# Altium project Mems_board.PrjPcb
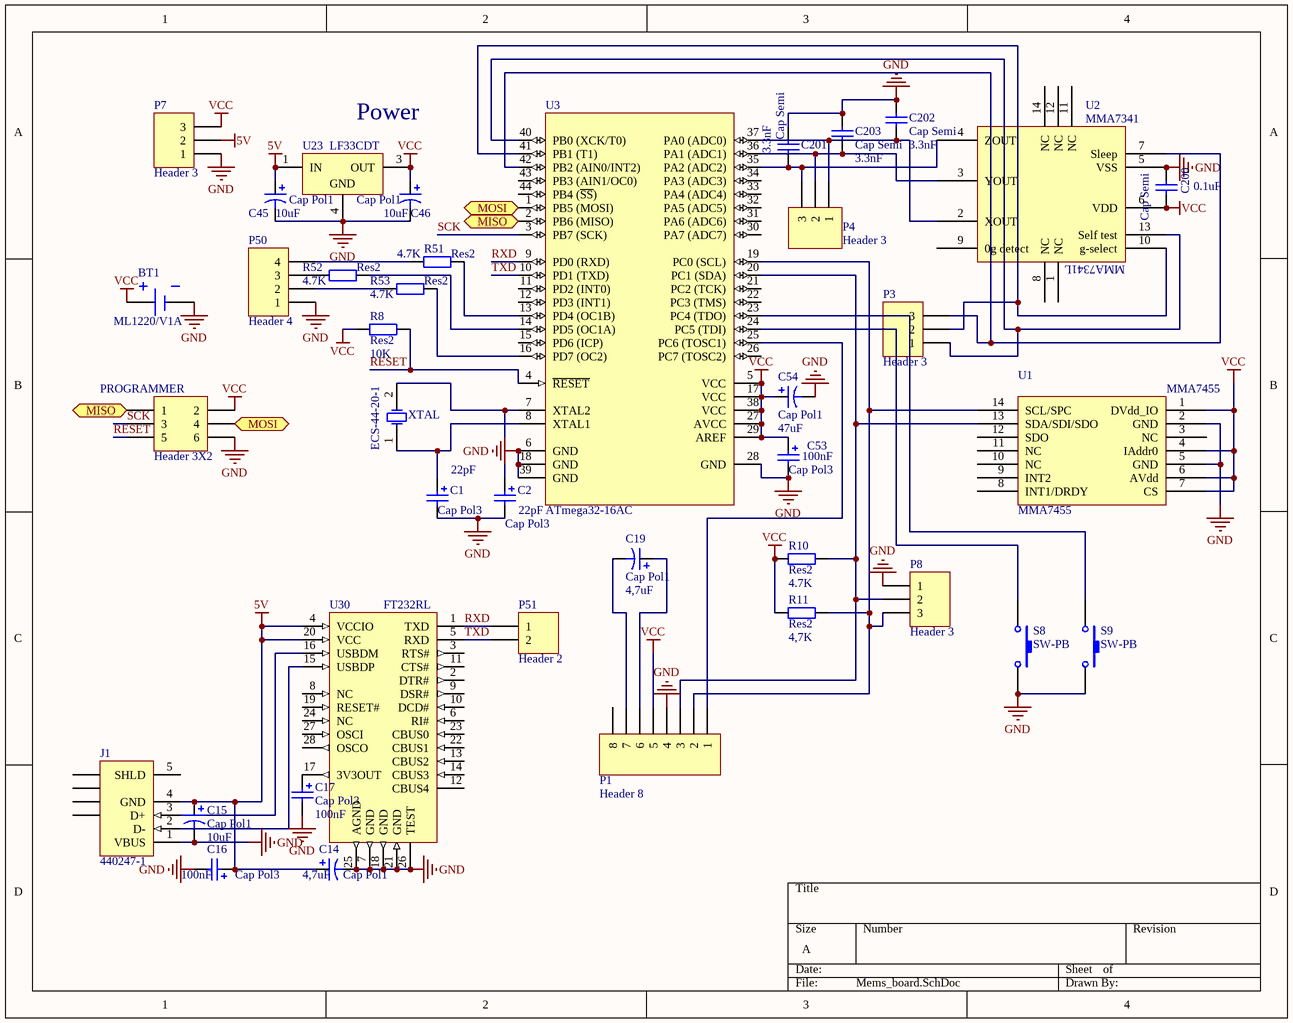
[diagram p0: Mems_board.SchDoc]
1 sheet, 39 parts. Net scope: flat (ports and power ports of the same name join across sheets).
Board files: Mems_board.PcbDoc, Mems_board_Panelize.PcbDoc

## Sheet Mems_board.SchDoc
size A

### Parts
BT1  ML1220/V1A  [ML1220-V]
C1  Cap Pol3  value 22pF  [RESC2012N]
C2  Cap Pol3  value 22pF  [RESC2012N]
C14  Cap Pol1  value 4,7uF  [CAPPR1.5-4x5]
C15  Cap Pol1  value 10uF  [CAPPR1.5-4x5]
C16  Cap Pol3  value 100nF  [RESC2012N]
C17  Cap Pol3  value 100nF  [RESC2012N]
C19  Cap Pol1  value 4,7uF  [CAPPR1.5-4x5]
C45  Cap Pol1  value 10uF  [CAPPR1.5-4x5]
C46  Cap Pol1  value 10uF  [CAPPR1.5-4x5]
C53  Cap Pol3  value 100nF  [RESC2012N]
C54  Cap Pol1  value 47uF  [CAPPR1.5-4x5]
C200  Cap Semi  value 0.1uF  [RESC2012N]
C201  Cap Semi  value 3.3nF  [RESC2012N]
C202  Cap Semi  value 3.3nF  [RESC2012N]
C203  Cap Semi  value 3.3nF  [RESC2012N]
J1  440247-1  [440247]
P1  Header 8  [FFC/SM1.0-2H8]
P3  Header 3  [HDR1X3]
P4  Header 3  [HDR1X3]
P7  Header 3  [HDR1X3]
P8  Header 3  [HDR1X3]
P50  Header 4  [HDR1X4]
P51  Header 2  [HDR1X2]
PROGRAMMER  Header 3X2  [HDR2X3]
R8  Res2  value 10K  [RESC2012N]
R10  Res2  value 4.7K  [RESC2012N]
R11  Res2  value 4,7K  [RESC2012N]
R51  Res2  value 4.7K  [RESC1608L]
R52  Res2  value 4.7K  [RESC1608L]
R53  Res2  value 4.7K  [RESC1608L]
S8  SW-PB  [HDR1X2]
S9  SW-PB  [HDR1X2]
U1  MMA7455  [LGA14 - duplicate]
U2  MMA7341  [LGA14 - duplicate]
U3  ATmega32-16AC  [44A_N]
U23  LF33CDT  [TO-252]
U30  FT232RL  [SSOP28]
XTAL  ECS-44-20-1  [HC-49U]

### Ports
MISO, MOSI

### Nets
5V: C14.1 C15.1 C16.1 C45.1 J1.4(GND) P7.2 U23.1(IN) U30.4(VCCIO) U30.20(VCC)
GND: BT1.2(-) C1.2 C2.2 C14.2 C15.2 C16.2 C17.2 C45.2 C46.2 C53.2 C54.2 C200.2 C201.2 C202.1 C203.1 J1.1(VBUS) P1.4 P7.1 P8.1 P50.1 PROGRAMMER.6 S8.2 S9.2 U1.2(GND) U1.5(GND) U2.5(VSS) U3.6(GND) U3.18(GND) U3.28(GND) U3.39(GND) U23.4(GND) U30.7(GND) U30.18(GND) U30.21(GND) U30.25(AGND) U30.26(TEST)
VCC: BT1.1(+) C46.1 C53.1 C54.1 C200.1 P1.5 P7.3 PROGRAMMER.2 R8.1 R10.1 R11.1 U1.1(DVdd_IO) U1.4(IAddr0) U1.6(AVdd) U1.7(CS) U2.6(VDD) U3.5(VCC) U3.17(VCC) U3.27(AVCC) U3.29(AREF) U3.38(VCC) U23.3(OUT)
RESET: PROGRAMMER.5 R8.2 U3.4(~{RESET})
RXD: P51.1 U3.9(PD0_(RXD)) U30.1(TXD)
SCK: PROGRAMMER.3 U3.3(PB7_(SCK))
TXD: P51.2 U3.10(PD1_(TXD)) U30.5(RXD)
NetC1_1: C1.1 U3.8(XTAL1) XTAL.1(OSC1)
NetC2_1: C2.1 U3.7(XTAL2) XTAL.2(OSC2)
NetC17_1: C17.1 U30.17(3V3OUT)
NetC19_1: C19.1 P1.6
NetC19_2: C19.2 P1.7
NetC201_1: C201.1 P4.3 U2.4(ZOUT) U3.35(PA2_(ADC2))
NetC202_2: C202.2 P4.1 U2.2(XOUT) U3.37(PA0_(ADC0))
NetC203_2: C203.2 P4.2 U2.3(YOUT) U3.36(PA1_(ADC1))
NetJ1_2: J1.2(D-) U30.15(USBDP)
NetJ1_3: J1.3(D+) U30.16(USBDM)
NetP1_1: P1.1 U3.25(PC6_(TOSC1))
NetP1_2: P1.2 P8.3 R11.2 U1.14(SCL/SPC) U3.19(PC0_(SCL))
NetP1_3: P1.3 P8.2 R10.2 U1.13(SDA/SDI/SDO) U3.20(PC1_(SDA))
NetP3_1: P3.1 U2.13(Self_test) U3.40(PB0_(XCK/T0))
NetP3_2: P3.2 U2.10(g-select) U3.41(PB1_(T1))
NetP3_3: P3.3 U2.7(Sleep) U3.42(PB2_(AIN0/INT2))
NetP50_2: P50.2 R53.1
NetP50_3: P50.3 R52.1
NetP50_4: P50.4 R51.1
NetPROGRAMMER_1: PROGRAMMER.1 U3.2(PB6_(MISO)) ; port MISO
NetPROGRAMMER_4: PROGRAMMER.4 U3.1(PB5_(MOSI)) ; port MOSI
NetR51_2: R51.2 U3.13(PD4_(OC1B))
NetR52_2: R52.2 U3.14(PD5_(OC1A))
NetR53_2: R53.2 U3.16(PD7_(OC2))
NetS8_1: S8.1 U3.24(PC5_(TDI))
NetS9_1: S9.1 U3.23(PC4_(TDO))

Not connected (* = marked no-connect by the designer): J1 5(SHLD) 6(SHLD) 7(SHLD) 8(SHLD) 9(SHLD); P1 8; U1 3(NC) 8(INT1/DRDY) 9(INT2) 10(NC) 11(NC) 12(SDO); U2 1(NC) 8(NC) 9(0g_detect) 11(NC) 12(NC) 14(NC); U3 11(PD2_(INT0)) 12(PD3_(INT1)) 15(PD6_(ICP)) 21(PC2_(TCK)) 22(PC3_(TMS)) 26(PC7_(TOSC2)) 30(PA7_(ADC7)) 31(PA6_(ADC6)) 32(PA5_(ADC5)) 33(PA4_(ADC4)) 34(PA3_(ADC3)) 43(PB3_(AIN1/OC0)) 44(PB4_(~{SS})); U30 2(DTR#) 3(RTS#) 6(RI#) 8(NC) 9(DSR#) 10(DCD#) 11(CTS#) 12(CBUS4) 13(CBUS2) 14(CBUS3) 19(RESET#) 22(CBUS1) 23(CBUS0) 24(NC) 27(OSCI) 28(OSCO)

### Notes on the sheet
- (near U23) Power
- (in symbol MMA7341) MMA7341L

### Library data of the parts
BT1 = ML1220/V1A: Manganese Rechargeable Lithium Battery with Legs, 3V, 17mAh, Vertical Coin-Type, 12.5x2mm (Dia.xH); Published: 30-May-2008; DatasheetVersion: Sep-2006; PackageVersion: Sep-2002; PackageReference: ML1220-V; Publisher: Altium Limited; PackageDescription: Lithium Disk Battery, Thru-Hole, Vertical; Body 12.5 x 2.6 mm (Dia.xW typ); ComponentLink1Description: Manufacturer Link; ComponentLink1URL: http://industrial.panasonic.com/; ComponentLink2Description: Datasheet; ComponentLink2URL: http://industrial.panasonic.com/www-data/pdf2/AAA4000/AAA4000CE69.pdf
C1 C2 C16 C17 C53 = Cap Pol3: Polarized Capacitor (Surface Mount); Published: 8-Jun-2000; LatestRevisionDate: 17-Jul-2002; LatestRevisionNote: Re-released for DXP Platform.; PackageReference: C0805; Publisher: Altium Limited
C14 C15 C19 C45 C46 C54 = Cap Pol1: Polarized Capacitor (Radial); Published: 8-Jun-2000; LatestRevisionDate: 17-Jul-2002; LatestRevisionNote: Re-released for DXP Platform.; PackageReference: RB7.6-15; Publisher: Altium Limited
C200-C203 = Cap Semi: Capacitor (Semiconductor SIM Model); Published: 8-Jun-2000; LatestRevisionDate: 29-May-2009; LatestRevisionNote: IPC-7351 Footprint Added.; PackageReference: C1206; Publisher: Altium Limited; PackageDescription: Chip Capacitor
J1 = 440247-1: USB 2.0, Right Angle, SMT, B Type, Receptacle, 5 Position, Black; ContactMaterial: Copper Alloy; ContactPlating: Gold (30); PCB_Layout: Complies with manufacturer's recommendation.; DrillSize: Corresponds to nominal value.; PanelGround: Without; Published: 15-Jul-2004; DatasheetDocument: 27-Jun-2003; PackageDocument: 27-Jun-2003; PackageReference: 440247; Publisher: Altium Limited; HousingMaterial: Thermoplastic; ComponentLink1Description: Manufacturer Link; ComponentLink1URL: http://www.tycoelectronics.com/; ComponentLink2Description: Packaging Specification; ComponentLink2URL: http://ecommas.tycoelectronics.com/commerce/DocumentDelivery/DDEController?Action=showdoc&DocId=Customer+Drawing%7F440247%7FD%7Fpdf%7FEnglish%7FC_440247_D.pdf
P1 = Header 8: Header, 8-Pin; LatestRevisionDate: 17-Jul-2002; LatestRevisionNote: Re-released for DXP Platform.; Publisher: Altium Limited
P3 P4 P7 P8 = Header 3: Header, 3-Pin; LatestRevisionDate: 17-Jul-2002; LatestRevisionNote: Re-released for DXP Platform.; Publisher: Altium Limited
P50 = Header 4: Header, 4-Pin; LatestRevisionDate: 17-Jul-2002; LatestRevisionNote: Re-released for DXP Platform.; Publisher: Altium Limited
P51 = Header 2: Header, 2-Pin; LatestRevisionDate: 17-Jul-2002; LatestRevisionNote: Re-released for DXP Platform.; Publisher: Altium Limited
PROGRAMMER = Header 3X2: Header, 3-Pin, Dual row; LatestRevisionDate: 17-Jul-2002; LatestRevisionNote: Re-released for DXP Platform.; Publisher: Altium Limited
R8 R10 R11 R51-R53 = Res2: Resistor; Published: 8-Jun-2000; LatestRevisionDate: 17-Jul-2002; LatestRevisionNote: Re-released for DXP Platform.; PackageReference: AXIAL-0.4; Publisher: Altium Limited
S8 S9 = SW-PB: Switch; Published: 24-Mar-1999; LatestRevisionDate: 17-Jul-2002; LatestRevisionNote: Re-released for DXP Platform.; PackageReference: SPST-2; Publisher: Altium Limited
U1 = MMA7455: MEMS; MMA7455: *
U2 = MMA7341: MEMS; MMA7341: *
U3 = ATmega32-16AC: 8-Bit AVR Microcontroller with 32K Bytes of In-System Programmable Flash Memory; Published: 17-Sep-2003; LatestRevisionDate: 13-Apr-2006; LatestRevisionNote: IPC-7351 Footprint Added.; DatasheetVersion: 2503C-AVR-10/02; PackageVersion: rev.B, Oct-2001; PackageReference: 44A; Publisher: Altium Limited; PackageDescription: 44-Pin Thin Quad Flat Pack 0.8 mm Pitch; ComponentLink1Description: Manufacturer Link; ComponentLink1URL: http://www.atmel.com; ComponentLink2Description: Datasheet; ComponentLink2URL: http://www.atmel.com/dyn/resources/prod_documents/doc2503.pdf
U23 = LF33CDT: 500mA, Very Low Drop (0.45V) Voltage Regulator; Published: 24-Aug-2001; LatestRevisionDate: 06-Jun-2005; LatestRevisionNote: PCB pads lengthened.; DatasheetVersion: Feb-2004; PackageVersion: Jun-2004; PackageReference: TO-252; Publisher: Altium Limited; PackageDescription: D-PAK/TO-252-AA; 3 Leads (1 Cropped); Body 10.1 (inc. leads) x 6.6 mm (LxW max); ComponentLink1Description: Manufacturer Link; ComponentLink1URL: http://www.st.com/; ComponentLink2Description: Datasheet; ComponentLink2URL: http://www.st.com/stonline/books/pdf/docs/2574.pdf
U30 = DS211E: 4 Driver/5 Receiver RS-232 Serial Port; Published: 13-Oct-2000; LatestRevisionDate: 06-Jun-2005; LatestRevisionNote: Stylized 3D Model Added.; DatasheetVersion: 15-Mar-1995; PackageVersion: Feb-1999; PackageReference: SSOP28; Publisher: Altium Limited; PackageDescription: SSOP, Plastic; 28 Leads; Body Width 5.3 mm; Pitch 0.65 mm; Code_JEDEC: MO-150-AH; ComponentLink1Description: Manufacturer Link; ComponentLink1URL: http://www.maxim-ic.com/
XTAL = ECS-44-20-1: Crystal Oscillator; Published: 17-Jul-2002; DatasheetDocument: 18-Apr-2000; PackageReference: HC-49U; Publisher: Altium Limited; ComponentLink1Description: Manufacturer Link; ComponentLink1URL: http://www.ecsxtal.com/; ComponentLink2Description: Datasheet; ComponentLink2URL: http://www.ecsxtal.com/pdf2/HC49U.PDF